# EasyEDA schematic SCH_Flight-Computer-V5_2024-08-18.json
TITLE: Flight Computer; REV: 1.0; Date: 2024-08-05; Sheet: 1/1; Drawn By: usedgenes; Company: Company
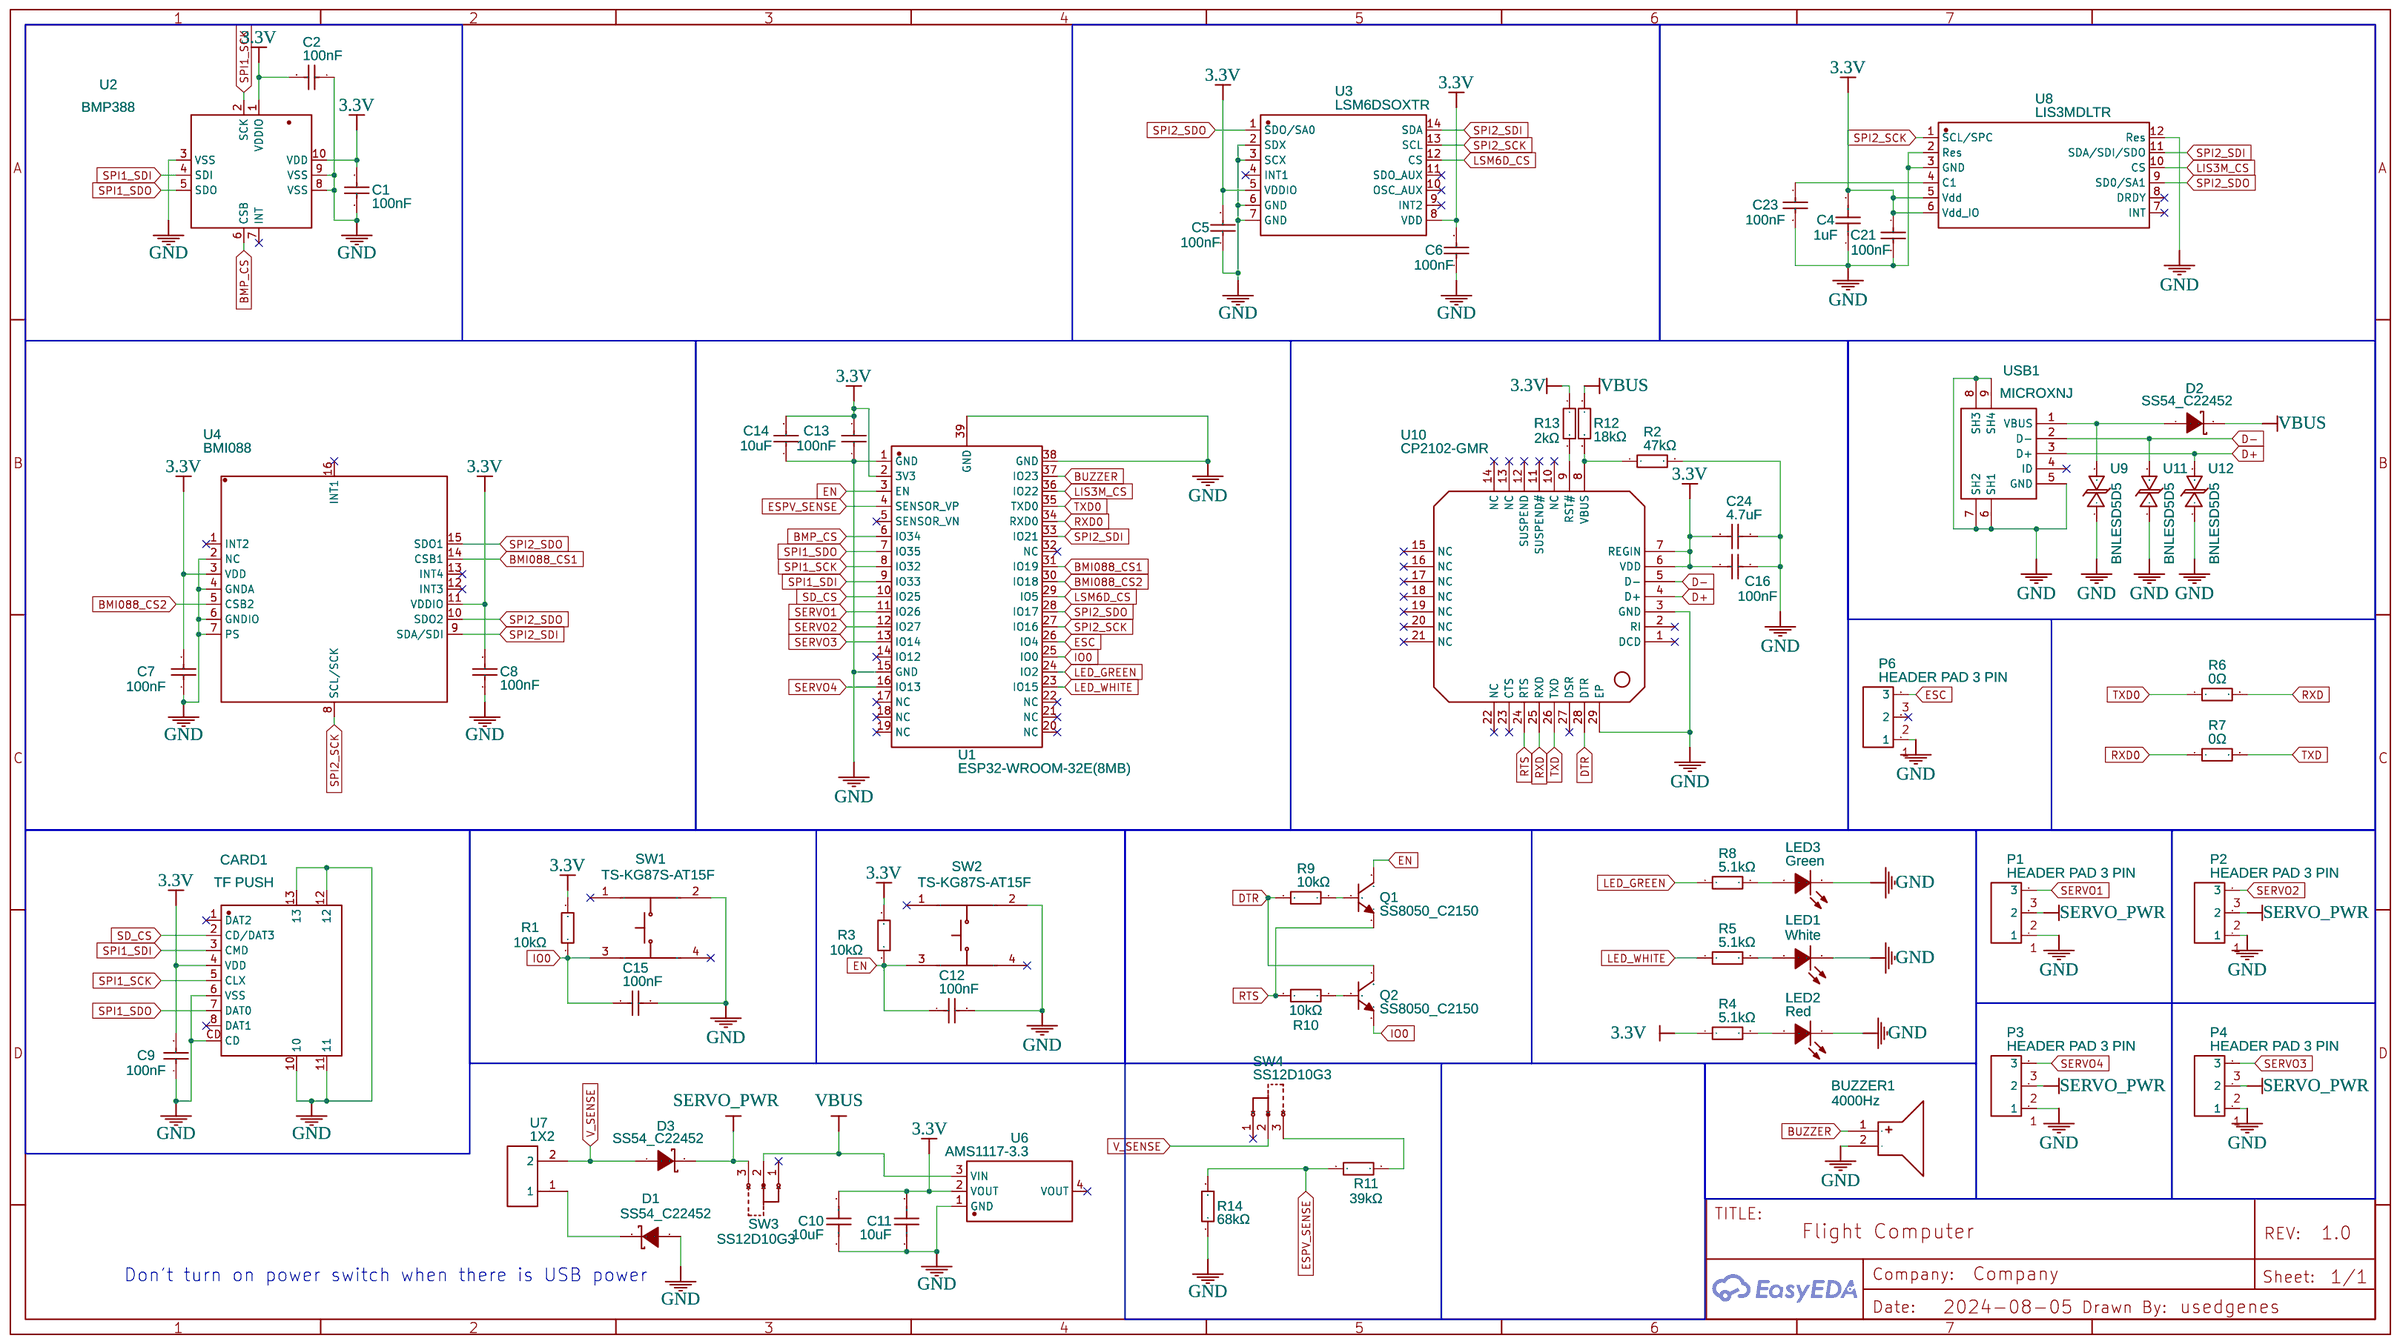
[diagram p0: schematic sheet]

## Parts
BUZZER1  4000Hz  [BUZ-TH_BD14.0-P7.60-D1.0-L]
C1  100nF  [C0402]
C2  100nF  [C0402]
C4  1uF  [C0402]
C5  100nF  [C0402]
C6  100nF  [C0402]
C7  100nF  [C0402]
C8  100nF  [C0402]
C9  100nF  [C0402]
C10  10uF  [C0603]
C11  10uF  [C0603]
C12  100nF  [C0402]
C13  100nF  [C0402]
C14  10uF  [C0402]
C15  100nF  [C0402]
C16  100nF  [C0402]
C21  100nF  [C0402]
C23  100nF  [C0402]
C24  4.7uF  [C0402]
CARD1  TF PUSH  [TF-SMD_TF-PUSH]
D1  SS54_C22452  [SMA_L4.4-W2.8-LS5.4-R-RD]
D2  SS54_C22452  [SMA_L4.4-W2.8-LS5.4-R-RD]
D3  SS54_C22452  [SMA_L4.4-W2.8-LS5.4-R-RD]
LED1  White  [LED0603-R-RD_WHITE]
LED2  Red  [LED0603-RD]
LED3  Green  [LED0805-R-RD]
P1  HEADER PAD 3 PIN  [CONNECTOR_PINHEADER_2.54MM:PINHEADER_1X3]
P2  HEADER PAD 3 PIN  [CONNECTOR_PINHEADER_2.54MM:PINHEADER_1X3]
P3  HEADER PAD 3 PIN  [CONNECTOR_PINHEADER_2.54MM:PINHEADER_1X3]
P4  HEADER PAD 3 PIN  [CONNECTOR_PINHEADER_2.54MM:PINHEADER_1X3]
P6  HEADER PAD 3 PIN  [CONNECTOR_PINHEADER_2.54MM:PINHEADER_1X3]
Q1  SS8050_C2150  [SOT-23-3_L2.9-W1.3-P1.90-LS2.4-BR]
Q2  SS8050_C2150  [SOT-23-3_L2.9-W1.3-P1.90-LS2.4-BR]
R1  10kΩ  [R0603]
R2  47kΩ  [R0402]
R3  10kΩ  [R0603]
R4  5.1kΩ  [R0402]
R5  5.1kΩ  [R0402]
R6  0Ω  [R1206]
R7  0Ω  [R1206]
R8  5.1kΩ  [R0402]
R9  10kΩ  [R0603]
R10  10kΩ  [R0603]
R11  39kΩ  [R0603]
R12  18kΩ  [R0603]
R13  2kΩ  [R0402]
R14  68kΩ  [R0603]
SW1  TS-KG87S-AT15F  [SW-SMD_4P-L5.2-W5.2-P3.70-LS6.4]
SW2  TS-KG87S-AT15F  [SW-SMD_4P-L5.2-W5.2-P3.70-LS6.4]
SW3  SS12D10G3  [SW-TH_3P-P4.8-L12.7-W6.7_SS12D10G3]
SW4  SS12D10G3  [SW-TH_3P-P4.8-L12.7-W6.7_SS12D10G3]
U1  ESP32-WROOM-32E(8MB)  [WIFI-SMD_ESP32-WROOM-32E]
U2  BMP388  [SENSORM-SMD_BMP388]
U3  LSM6DSOXTR  [LGA-14L_L3.0-W2.5-P0.50-TL]
U4  BMI088  [LGA-16_L4.5-W3.0-P0.50-BL]
U6  AMS1117-3.3  [SOT-223-3_L6.5-W3.4-P2.30-LS7.0-BR]
U7  1X2  [PIN HEADER CONNECTOR 1X2 PINS_PITCH 2.54MM]
U8  LIS3MDLTR  [LGA-12_L2.0-W2.0-P0.50-BL]
U9  BNLESD5D5  [SOD-523_L1.2-W0.8-LS1.6-BI]
U10  CP2102-GMR  [WQFN-28_L5.0-W5.0-P0.50-BL-EP3.2]
U11  BNLESD5D5  [SOD-523_L1.2-W0.8-LS1.6-BI]
U12  BNLESD5D5  [SOD-523_L1.2-W0.8-LS1.6-BI]
USB1  MICROXNJ  [MICRO-USB-SMD_MICROXNJ]

## Library data of the parts
BUZZER1 = SKY-1475-0540-45P7.6: Contributor: LCSC; Supplier: LCSC; Supplier Part: C511707; Manufacturer: S&S(海旭); JLCPCB Part Class: Extended Part
C1 C2 C5-C9 C12 C13 C15 C16 C21 C23 = CL05B104KO5NNNC: Supplier: LCSC; Manufacturer: SAMSUNG(三星); Supplier Part: C1525; JLCPCB Part Class: Basic Part
C4 = CL05A105KA5NQNC: Supplier: LCSC; Manufacturer: SAMSUNG(三星); Supplier Part: C52923; JLCPCB Part Class: Basic Part
C10 C11 = CL10A106KP8NNNC: Supplier: LCSC; Manufacturer: SAMSUNG(三星); Supplier Part: C19702; JLCPCB Part Class: Basic Part
C14 = CL05A106MQ5NUNC: Supplier: LCSC; Manufacturer: SAMSUNG(三星); Supplier Part: C15525; JLCPCB Part Class: Basic Part
C24 = CL05A475MP5NRNC: Supplier: LCSC; Manufacturer: SAMSUNG(三星); Supplier Part: C23733; JLCPCB Part Class: Basic Part
CARD1 = TF PUSH: Contributor: LCSC; Supplier: LCSC; Supplier Part: C393941; Manufacturer: SHOU HAN(首韩); JLCPCB Part Class: Extended Part
D1-D3 = SS54_C22452: Supplier: LCSC; Manufacturer Part: SS54; Manufacturer: MDD(辰达半导体); Supplier Part: C22452; JLCPCB Part Class: Basic Part
LED1 = 0603White light_C2290: Supplier: LCSC; Manufacturer: KENTO; Manufacturer Part: KT-0603白灯; Supplier Part: C2290; JLCPCB Part Class: Basic Part
LED2 = KT-0603R: Supplier: LCSC; Manufacturer: KENTO; Supplier Part: C2286; JLCPCB Part Class: Basic Part
LED3 = 0805G (Green): Supplier: LCSC; Manufacturer: KENTO; Manufacturer Part: KT-0805G; Supplier Part: C2297; JLCPCB Part Class: Basic Part
P1-P4 P6 = HEADER PAD 3 PIN: Supplier: LCSC; Manufacturer: BOOMELE; Manufacturer Part: Female headerHDR1X8-2.54; Supplier Part: C27438; JLCPCB Part Class: Extended Part; Contributor: juchani
Q1 Q2 = SS8050_C2150: Supplier: LCSC; Manufacturer: CJ(江苏长电/长晶); Manufacturer Part: SS8050; Supplier Part: C2150; JLCPCB Part Class: Basic Part
R1 R3 R9 R10 = 0603WAF1002T5E: Supplier: LCSC; Manufacturer: UNI-ROYAL(厚声); Supplier Part: C25804; JLCPCB Part Class: Basic Part
R2 = 0402WGF4702TCE: Supplier: LCSC; Manufacturer: UNI-ROYAL(厚声); Supplier Part: C25792; JLCPCB Part Class: Basic Part
R4 R5 R8 = 0402WGF5101TCE: Supplier: LCSC; Manufacturer: UNI-ROYAL(厚声); Supplier Part: C25905; JLCPCB Part Class: Basic Part
R6 R7 = 1206W4F0000T5E: Supplier: LCSC; Manufacturer: UNI-ROYAL(厚声); Supplier Part: C17888; JLCPCB Part Class: Basic Part
R11 = 0603WAF3902T5E: Supplier: LCSC; Manufacturer: UNI-ROYAL(厚声); Supplier Part: C23153; JLCPCB Part Class: Basic Part
R12 = 0603WAF1802T5E: Supplier: LCSC; Manufacturer: UNI-ROYAL(厚声); Supplier Part: C25810; JLCPCB Part Class: Basic Part
R13 = 0402WGF2001TCE: Supplier: LCSC; Manufacturer: UNI-ROYAL(厚声); Supplier Part: C4109; JLCPCB Part Class: Basic Part
R14 = 0603WAF6802T5E: Supplier: LCSC; Manufacturer: UNI-ROYAL(厚声); Supplier Part: C23231; JLCPCB Part Class: Basic Part
SW1 SW2 = TS-KG87S-AT15F: Contributor: LCSC; Supplier: LCSC; Supplier Part: C2874421; Manufacturer: HANBO(汉博); JLCPCB Part Class: Extended Part
SW3 SW4 = SS12D10G3: Supplier: LCSC; Supplier Part: C7431053; Manufacturer: SHOU HAN(首韩); Contributor: lcsc
U1 = ESP32-WROOM-32E(8MB): Contributor: LCSC; Supplier: LCSC; Supplier Part: C701342; Manufacturer: ESPRESSIF(乐鑫); Manufacturer Part: ESP32-WROOM-32E-N8; JLCPCB Part Class: Extended Part
U2 = BMP388: Contributor: LCSC; Supplier: LCSC; Supplier Part: C779278; Manufacturer: Bosch(博世); JLCPCB Part Class: Extended Part
U3 = LSM6DSOXTR: Contributor: LCSC; Supplier: LCSC; Supplier Part: C481766; Manufacturer: ST(意法半导体); JLCPCB Part Class: Extended Part
U4 = BMI088: Contributor: LCSC; Supplier: LCSC; Supplier Part: C194919; Manufacturer: Bosch(博世); JLCPCB Part Class: Extended Part
U6 = AMS1117-3.3: sourceId: dwIGgezVh; Supplier: LCSC; Manufacturer: AMS; Supplier Part: w; JLCPCB Part Class: Basic Part
U7 = 1X2: Contributor: suriya.chun
U8 = LIS3MDLTR: Contributor: LCSC; Supplier: LCSC; Supplier Part: C478483; Manufacturer: ST(意法半导体); JLCPCB Part Class: Extended Part
U9 U11 U12 = BNLESD5D5.0CT1G: Supplier: LCSC; Supplier Part: C20416613; Manufacturer: BORN(伯恩半导体); JLCPCB Part Class: Extended Part; Contributor: lcsc
U10 = CP2102-GMR: Supplier: LCSC; Manufacturer: SKYWORKS/SILICON LABS(芯科); Supplier Part: C6568; JLCPCB Part Class: Extended Part
USB1 = MICROXNJ: Contributor: LCSC; Supplier: LCSC; Supplier Part: C404969; Manufacturer: SHOU HAN(首韩); Manufacturer Part: MicroXNJ; JLCPCB Part Class: Extended Part

## Nets
3.3V: C1.2 C2.2 C4.2 C5.2 C6.2 C7.2 C8.2 C9.2 C10.2 C11.2 C13.2 C14.2 C16.1 C21.1 C24.1 CARD1.4(VDD) R1.2 R3.2 R4.1 R13.1 U1.2(3V3) U2.1(VDDIO) U2.10(VDD) U3.5(VDDIO) U3.8(VDD) U4.3(VDD) U4.11(VDDIO) U6.2(VOUT) U8.5(Vdd) U8.6(Vdd_IO) U10.6(VDD) U10.7(REGIN)
GND: BUZZER1.2(-) C1.1 C2.1 C4.1 C5.1 C6.1 C7.1 C8.1 C9.1 C10.1 C11.1 C12.2 C13.1 C14.1 C15.2 C16.2 C21.2 C23.2 C24.2 CARD1.6(VSS) CARD1.10 CARD1.11 CARD1.12 CARD1.13 CARD1.CD D1.1(A) LED1.2(K) LED2.1(K) LED3.2(K) P1.1 P2.1 P3.1 P4.1 P6.1 R2.2 R14.1 SW1.2 SW2.2 U1.1(GND) U1.15(GND) U1.38(GND) U1.39(GND) U2.3(VSS) U2.8(VSS) U2.9(VSS) U3.2(SDX) U3.3(SCX) U3.6(GND) U3.7(GND) U4.2(NC) U4.4(GNDA) U4.6(GNDIO) U4.7(PS) U6.1(GND) U8.2(Res) U8.3(GND) U8.12(Res) U9.1 U10.3(GND) U10.29(EP) U11.1 U12.1 USB1.5(GND) USB1.6(SH1) USB1.7(SH2) USB1.8(SH3) USB1.9(SH4)
VBUS: D2.2(K) R12.1 SW3.2 U6.3(VIN)
BMI088_CS1: U1.31(IO19) U4.14(CSB1)
BMI088_CS2: U1.30(IO18) U4.5(CSB2)
BMP_CS: U1.6(IO34) U2.6(CSB)
BUZZER: BUZZER1.1(+) U1.37(IO23)
D+: U10.4(D+) U12.2 USB1.3(D+)
D-: U10.5(D-) U11.2 USB1.2(D-)
DTR: Q2.3(C) R9.2 U10.28(DTR)
EN: C12.1 Q1.3(C) R3.1 SW2.3 U1.3(EN)
ESC: P6.3 U1.26(IO4)
ESPV_SENSE: R11.1 R14.2 U1.4(SENSOR_VP)
IO0: C15.1 Q2.2(E) R1.1 SW1.3 U1.25(IO0)
LED_GREEN: R8.1 U1.24(IO2)
LED_WHITE: R5.1 U1.23(IO15)
LIS3M_CS: U1.36(IO22) U8.10(CS)
LSM6D_CS: U1.29(IO5) U3.12(CS)
RTS: Q1.2(E) R10.1 U10.24(RTS)
RXD: R6.2 U10.25(RXD)
RXD0: R7.1 U1.34(RXD0)
SD_CS: CARD1.2(CD/DAT3) U1.10(IO25)
SERVO1: P1.3 U1.11(IO26)
SERVO2: P2.3 U1.12(IO27)
SERVO3: P4.3 U1.13(IO14)
SERVO4: P3.3 U1.16(IO13)
SERVO_PWR: D3.2(K) P1.2 P2.2 P3.2 P4.2 SW3.3
SPI1_SCK: CARD1.5(CLX) U1.8(IO32) U2.2(SCK)
SPI1_SDI: CARD1.3(CMD) U1.9(IO33) U2.4(SDI)
SPI1_SDO: CARD1.7(DAT0) U1.7(IO35) U2.5(SDO)
SPI2_SCK: U1.27(IO16) U3.13(SCL) U4.8(SCL/SCK) U8.1(SCL/SPC)
SPI2_SDI: U1.33(IO21) U3.14(SDA) U4.9(SDA/SDI) U8.11(SDA/SDI/SDO)
SPI2_SDO: U1.28(IO17) U3.1(SDO/SA0) U4.10(SDO2) U4.15(SDO1) U8.9(SD0/SA1)
TXD: R7.2 U10.26(TXD)
TXD0: R6.1 U1.35(TXD0)
V_SENSE: D3.1(A) SW4.2 U7.2
Net-(C23-1): C23.1 U8.4(C1)
Net-(D1-2): D1.2(K) U7.1
Net-(D2-1): D2.1(A) U9.2 USB1.1(VBUS)
Net-(LED1-1): LED1.1(A) R5.2
Net-(LED2-2): LED2.2(A) R4.2
Net-(LED3-1): LED3.1(A) R8.2
Net-(Q1-1): Q1.1(B) R9.1
Net-(Q2-1): Q2.1(B) R10.2
Net-(R2-1): R2.1 R12.2 U10.8(VBUS)
Net-(R11-2): R11.2 SW4.3
Net-(R13-2): R13.2 U10.9(RST#)

Not connected (* = marked no-connect by the designer): CARD1 1(DAT2)* 8(DAT1)*; P6 2*; SW1 1* 4*; SW2 1* 4*; SW3 1*; SW4 1*; U1 5(SENSOR_VN)* 14(IO12)* 17(NC)* 18(NC)* 19(NC)* 20(NC)* 21(NC)* 22(NC)* 32(NC)*; U2 7(INT)*; U3 4(INT1)* 9(INT2)* 10(OSC_AUX)* 11(SDO_AUX)*; U4 1(INT2)* 12(INT3)* 13(INT4)* 16(INT1)*; U6 4(VOUT)*; U8 7(INT)* 8(DRDY)*; U10 1(DCD)* 2(RI)* 10(NC)* 11(SUSPEND#)* 12(SUSPEND)* 13(NC)* 14(NC)* 15(NC)* 16(NC)* 17(NC)* 18(NC)* 19(NC)* 20(NC)* 21(NC)* 22(NC)* 23(CTS)* 27(DSR)*; USB1 4(ID)*

## Notes on the sheet
- Don't turn on power switch when there is USB power
